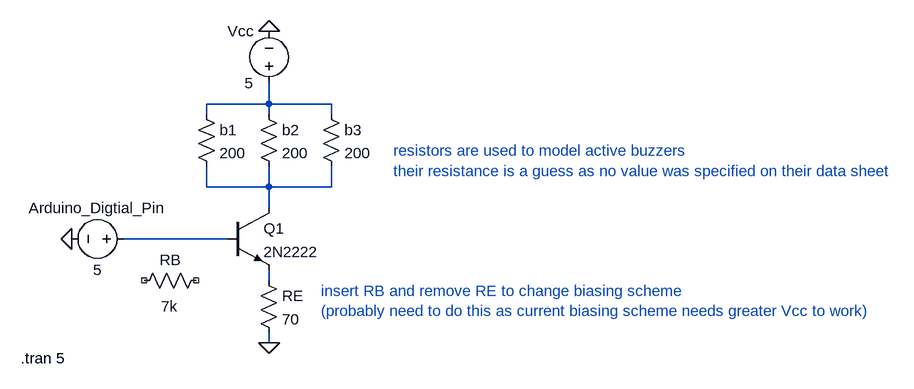
[diagram p0: schematic active_buzzer_circuit.asc]
active_buzzer_circuit.asc, the LTspice schematic file:
Version 4
SHEET 1 1324 680
WIRE 224 -16 224 -48
WIRE 224 -16 128 -16
WIRE 320 -16 224 -16
WIRE 128 0 128 -16
WIRE 224 0 224 -16
WIRE 320 0 320 -16
WIRE 128 112 128 80
WIRE 224 112 224 80
WIRE 224 112 128 112
WIRE 320 112 320 80
WIRE 320 112 224 112
WIRE 224 144 224 112
WIRE 160 192 0 192
WIRE 224 256 224 240
WIRE 224 352 224 336
FLAG 224 352 0
FLAG 224 -128 0
FLAG -80 192 0
SYMBOL npn 160 144 R0
SYMATTR InstName Q1
SYMATTR Value 2N2222
SYMBOL res 208 240 R0
SYMATTR InstName RE
SYMATTR Value 70
SYMBOL voltage 224 -32 R180
WINDOW 0 24 96 Left 2
WINDOW 3 24 16 Left 2
SYMATTR InstName Vcc
SYMATTR Value 5
SYMBOL voltage 16 192 R90
WINDOW 0 -32 56 VBottom 2
WINDOW 3 32 56 VTop 2
SYMATTR InstName Arduino_Digtial_Pin
SYMATTR Value 5
SYMBOL res 112 -16 R0
SYMATTR InstName b1
SYMATTR Value 200
SYMBOL res 208 -16 R0
SYMATTR InstName b2
SYMATTR Value 200
SYMBOL res 304 -16 R0
SYMATTR InstName b3
SYMATTR Value 200
SYMBOL res 128 240 R90
WINDOW 0 0 56 VBottom 2
WINDOW 3 40 57 VTop 2
SYMATTR InstName RB
SYMATTR Value 7k
TEXT 416 56 Left 2 ;resistors are used to model active buzzers\ntheir resistance is a guess as no value was specified on their data sheet
TEXT -158 376 Left 2 !.tran 5
TEXT 304 272 Left 2 ;insert RB and remove RE to change biasing scheme\n(probably need to do this as current biasing scheme needs greater Vcc to work)

The netlist it stands for:
* active_buzzer_circuit.asc
Q1 N002 N003 N004 0 2N2222
RE N004 0 70
Vcc N001 0 5
V§Arduino_Digtial_Pin N003 0 5
R§b1 N001 N002 200
R§b2 N001 N002 200
R§b3 N001 N002 200
RB NC_01 NC_02 7k
.model NPN NPN
.model PNP PNP
.lib standard.bjt
* resistors are used to model active buzzers
* their resistance is a guess as no value was specified on their data sheet
.tran 5
* insert RB and remove RE to change biasing scheme
* (probably need to do this as current biasing scheme needs greater Vcc to work)
.backanno
.end